# EasyEDA Pro project comparatorVCO.eprj, board PCB2_1
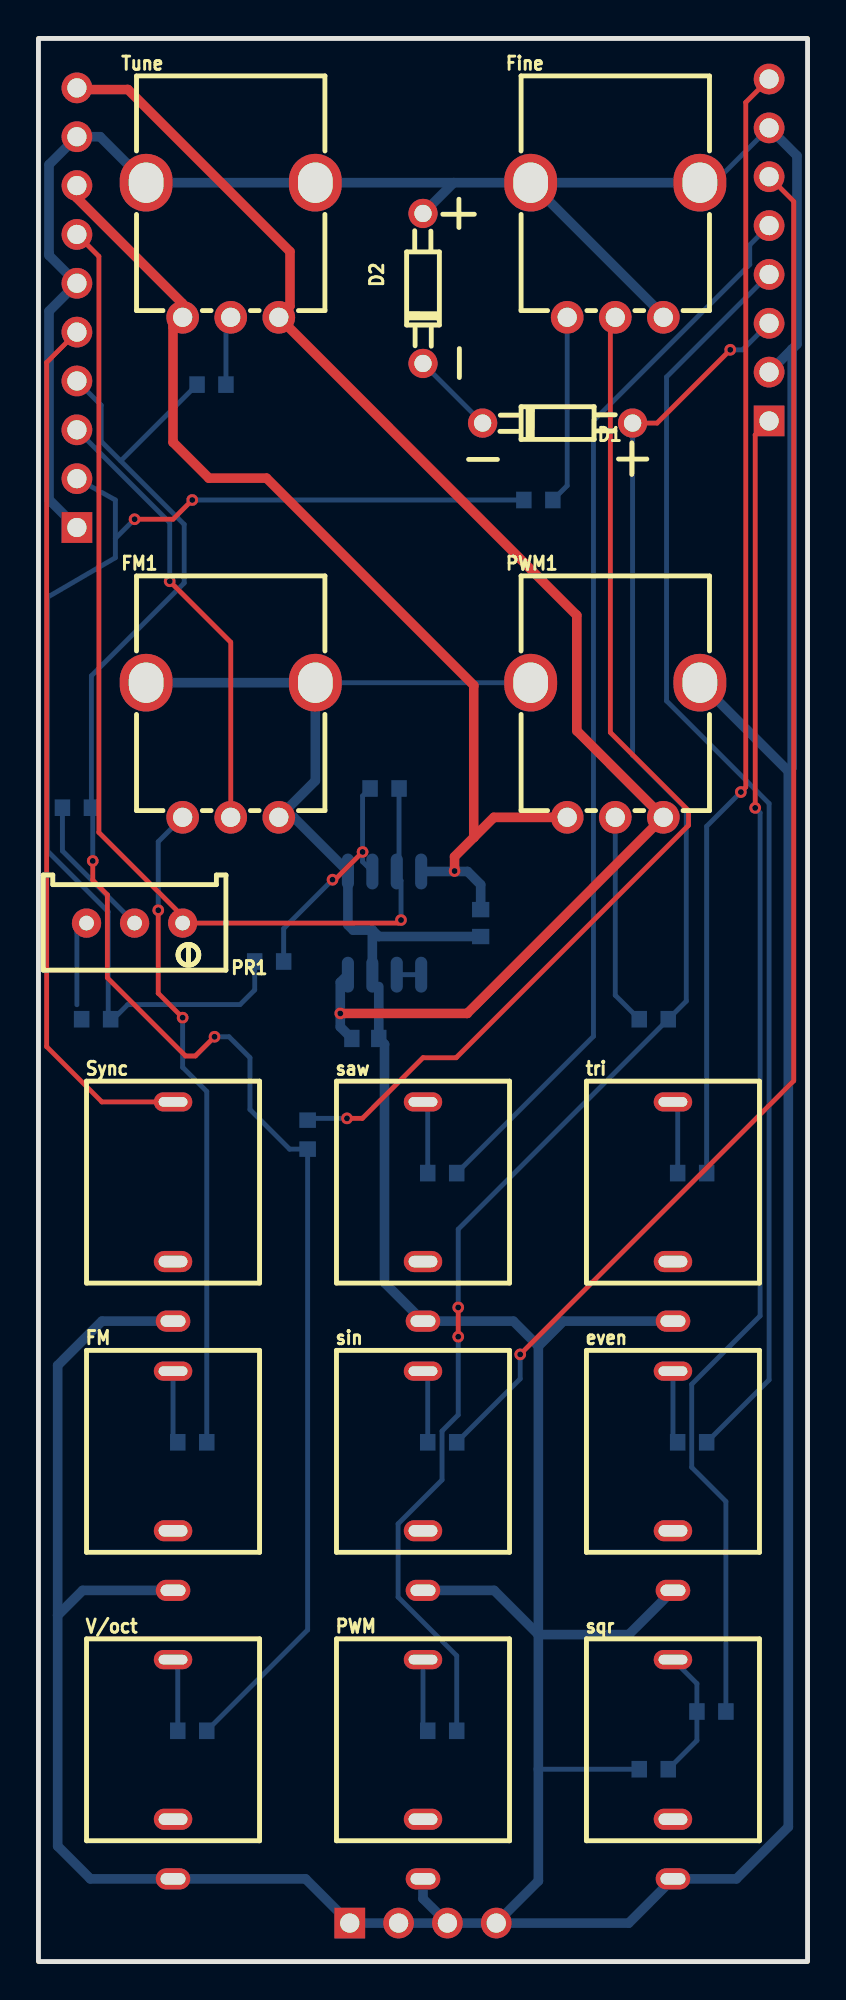
[diagram p8: board, top side]
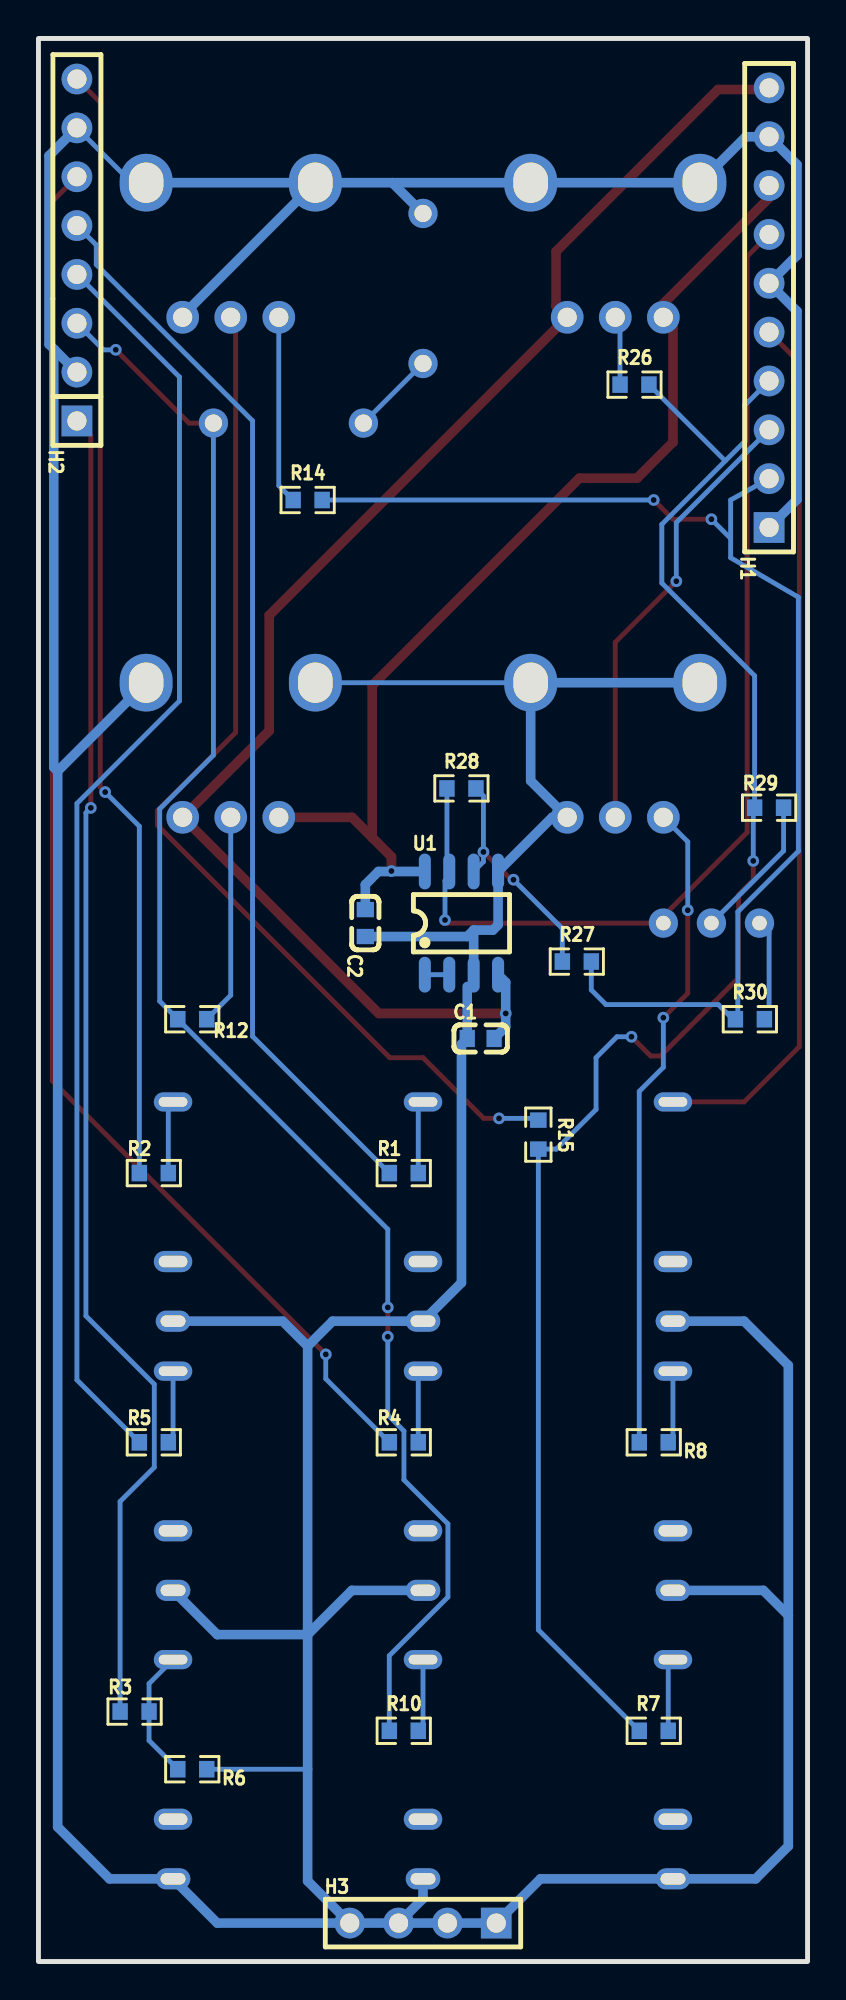
[diagram p9: board, bottom side, seen from below]

Outline 40 x 100 mm; copper layers: Top Layer, Bottom Layer. Coordinates in mm from the lower left corner of the outline.
Outline path: rectangle 0,100 40,0
Stack: Top Layer 0.035mm / Dielectric1 1.51mm FR4 er 4.5 / Bottom Layer 0.035mm

## Design rules (mm)
template: Custom Config
spacing copperThickness1oz (default): track to track 0.102, other pairs 0.152 to 0.3
spacing copperThickness2oz: track to track 0.203, other pairs 0.152 to 0.3
track width copperThickness1oz (default): min 0.127, default 0.254, max 2.54
track width copperThickness2oz: min 0.203, default 0.254, max 2.54
differential pair differentialPair (default): width min 0.127, default 0.254, max 2.54; gap min 0.152, default 0.152
via viaSize (default): diameter min 0.5, default 0.61, max 10; hole min 0.3, default 0.305, max 6.3

## Placement (name value [footprint] x y rotation side)
C1  100nF  [C0603]  17 48 180 bottom
C2  100nF  [C0603]  23 54 90 bottom
D1  BZX55C4V7-TAP  [DO-35_BD1.7-L3.8-P7.8-D0.5-FD]  27 80 180 top
D2  BZX55C4V7-TAP  [DO-35_BD1.7-L3.8-P7.8-D0.5-FD]  20 87 270 top
even  WQP-WQP518MA  [CONN-TH_WQP-WQP518MA]  33 25 0 top
Fine  100kΩ  [RES-ADJ-TH_RK09D1130C3C]  30 89 0 top
FM  WQP-WQP518MA  [CONN-TH_WQP-WQP518MA]  7 25 0 top
FM1  100kΩ  [RES-ADJ-TH_RK09D1130C3C]  10 63 0 top
H1  HTSW-110-07-G-S  [HDR-TH_TSW-110-17-F-S-LL]  2 86 90 bottom
H2  HTSW-108-22-T-S  [HDR-TH_HTSW-108-22-T-S]  38 89 90 bottom
H3  HTSW-104-18-F-S  [HDR-TH_HTSW-104-25-S-S-LL]  20 2 180 bottom
PR1  10kΩ  [RES-ADJ-TH_3P-L10.0-W10.0-P2.50-L]  5 54 180 top
PWM  WQP-WQP518MA  [CONN-TH_WQP-WQP518MA]  20 10 0 top
PWM1  100kΩ  [RES-ADJ-TH_RK09D1130C3C]  30 63 0 top
R1  1k  [R0603]  21 41 180 bottom
R2  1k  [R0603]  34 41 180 bottom
R3  3.3k  [R0603]  35 13 180 bottom
R4  1k  [R0603]  21 27 180 bottom
R5  1k  [R0603]  34 27 180 bottom
R6  3.3k  [R0603]  32 10 0 bottom
R7  100k 0.1%  [R0603]  8 12 0 bottom
R8  100K  [R0603]  8 27 0 bottom
R10  47k  [R0603]  21 12 0 bottom
R12  12k  [R0603]  32 49 0 bottom
R14  130k  [R0603]  26 76 0 bottom
R15  100k  [R0603]  14 43 270 bottom
R26  50k .1%  [R0603]  9 82 180 bottom
R27  10K  [R0603]  12 52 0 bottom
R28  10K  [R0603]  18 61 0 bottom
R29  100k  [R0603]  2 60 180 bottom
R30  36k  [R0603]  3 49 180 bottom
saw  WQP-WQP518MA  [CONN-TH_WQP-WQP518MA]  20 39 0 top
sin  WQP-WQP518MA  [CONN-TH_WQP-WQP518MA]  20 25 0 top
sqr  WQP-WQP518MA  [CONN-TH_WQP-WQP518MA]  33 10 0 top
Sync  WQP-WQP518MA  [CONN-TH_WQP-WQP518MA]  7 39 0 top
tri  WQP-WQP518MA  [CONN-TH_WQP-WQP518MA]  33 39 0 top
Tune  100kΩ  [RES-ADJ-TH_RK09D1130C3C]  10 89 0 top
U1  TL082  [SOP-8_L4.9-W3.9-P1.27-LS6.0-BL]  18 54 180 bottom
V/oct  WQP-WQP518MA  [CONN-TH_WQP-WQP518MA]  7 10 0 top

## Footprints (pads in the part's own frame, mm; a bottom-side part is the same pattern mirrored in y, then rotated)
C0603
  rect 0.8x0.9 smd: 1(-0.7,0) 2(0.7,0)
CONN-TH_WQP-WQP518MA
  oval 1.8x1.1 hole 1.3x0.6: 1(0,-5.7)
  oval 2x1.1 hole 1.5x0.6: 2(0,-2.6)
  oval 2x1 hole 1.5x0.5: 3(0,5.7)
DO-35_BD1.7-L3.8-P7.8-D0.5-FD
  round 1.524 hole 0.9: 1(3.9,0) 2(-3.9,0)
HDR-TH_HTSW-104-25-S-S-LL
  rect 1.6x1.6 hole 1: 1(3.81,0)
  round 1.6 hole 1: 2(1.27,0) 3(-1.27,0) 4(-3.81,0)
HDR-TH_HTSW-108-22-T-S
  rect 1.6x1.6 hole 1: 1(-8.89,0)
  round 1.6 hole 1: 2(-6.35,0) 3(-3.81,0) 4(-1.27,0) 5(1.27,0) 6(3.81,0) 7(6.35,0) 8(8.89,0)
HDR-TH_TSW-110-17-F-S-LL
  rect 1.6x1.6 hole 1: 1(-11.43,0)
  round 1.6 hole 1: 2(-8.89,0) 3(-6.35,0) 4(-3.81,0) 5(-1.27,0) 6(1.27,0) 7(3.81,0) 8(6.35,0) 9(8.89,0) 10(11.43,0)
R0603
  rect 0.806x0.864 smd: 1(-0.753,0) 2(0.753,0)
RES-ADJ-TH_3P-L10.0-W10.0-P2.50-L
  round 1.524 hole 0.762: 1(-2.5,0) 2(0,0) 3(2.5,0)
RES-ADJ-TH_RK09D1130C3C
  round 1.7 hole 1: 1(-2.5,-3.5) 2(0,-3.5) 3(2.5,-3.5)
  oval 2.75x3 hole 1.8x2.1: 4(-4.4,3.5) 5(4.4,3.5)
SOP-8_L4.9-W3.9-P1.27-LS6.0-BL
  oval 0.63x1.865 smd: 1(-1.905,-2.683) 2(-0.635,-2.683) 3(0.635,-2.683) 4(1.905,-2.683) 5(1.905,2.683) 6(0.635,2.683) 7(-0.635,2.683) 8(-1.905,2.683)

## Nets
As in the schematic.

Pads without a net: even 2; FM 2; PWM 2; saw 2; sin 2; sqr 2; Sync 2; tri 2; V/oct 2

## Via types
v1: diameter 0.61, hole 0.305, Top Layer to Bottom Layer, 19 vias

## Routing (per net, layer and track width the routed paths; a pad name or vN(x,y) marks a point on that pad's centre or on a via; arc(x,y) is an arc through that point)
+12V: length 56.7
  Top Layer w0.5: H1.8 2,91.71 7.5,86.21 Tune.1 7,85 7,79 8.86,77.14 11.86,77.14 22.64,66.36 22.64,58.45 ; v1(21.64,56.71) 21.64,57.45 22.64,58.45 ; 22.64,58.45 23.69,59.5 PWM1.1
  Bottom Layer w0.5: U1.8 22.32,56.68 23,56 C2.2
-12V: length 77.3
  Top Layer w0.5: v1(15.7,49.3) 22.3,49.3 PWM1.3 28,64 28,70 Tune.3 13.08,86.08 13.08,88.92 4.66,97.34 2.09,97.34 H1.10
  Bottom Layer w0.5: U1.4 15.7,50.92 v1(15.7,49.3) 15.7,48.6 C1.2
GND: length 381.7
  Bottom Layer w0.254: R6.1 26,10 ; FM1.5 PWM1.4 ; H2.7 35.15,92.5 Fine.5
  Bottom Layer w0.5: 21.6,92.5 Tune.5 Tune.4 3.21,94.89 H1.9 0.55,93.44 0.55,88.72 H1.6 0.55,85.82 0.55,76.02 H1.1 ; 21.6,92.5 Fine.4 ; 21.6,92.5 D2.2 ; H2.7 39.45,93.9 39.45,84.1 39.18,83.83 ; 26,32 27.3,33.3 tri.1 ; 26,32 26,17 ; 26,32 24.7,33.3 saw.1 18,35.3 18,47.7 C1.1 17.7,50.7 ; even.1 30.7,17 26,17 ; H3.4 26,4.19 26,17 ; H3.4 30.7,2 sqr.1 36.3,4.3 39,7 39,61.9 ; H3.4 H3.3 ; Fine.4 Fine.5 ; Fine.4 32.5,85.6 Fine.3 ; 17.37,53.64 17.7,53.3 C2.1 ; 17.37,53.64 16.37,53.64 16.09,53.91 U1.5 13.28,59.5 FM1.3 14.4,61.4 FM1.5 FM1.4 ; 17.37,53.64 U1.3 ; 39.18,83.83 H2.2 ; 39.18,83.83 39.2,83.8 39.2,62.1 39,61.9 ; 26,17 23.7,19.3 sin.1 ; PWM.1 20,3.27 H3.3 ; H3.3 H3.2 H3.1 13.89,4.3 V/oct.1 2.7,4.3 1,6 1,18 ; 1,18 1,31 3.3,33.3 Sync.1 ; 1,18 2.3,19.3 FM.1 ; 39,61.9 PWM1.5
-V_REF: length 56.6
  Top Layer w0.254: 7.71,54.14 7.64,54.14 PR1.1 ; 7.71,54.14 3.14,58.71 3.14,88.67 H1.7 ; 7.71,54.14 7.86,54 18.7,54 v1(18.86,54.16)
  Bottom Layer w0.254: R28.2 18.75,56.8 U1.7 18.63,56.43 18.86,56.21 v1(18.86,54.16)
EVEN_OUT: length 66.5
  Bottom Layer w0.254: H2.4 32.67,82.4 32.67,65.55 38,60.22 38,30.25 R5.1
FM_IN: length 23.5
  Top Layer w0.254: FM1.2 10,68.6 v1(6.83,71.78)
  Bottom Layer w0.254: v1(6.83,71.78) 6.83,74.82 H1.3
PW_IN: length 85.9
  Top Layer w0.254: v1(35.98,83.81) 32.17,80 D1.2 ; v1(21.83,34.01) v1(21.83,32.49)
  Bottom Layer w0.254: v1(21.83,34.01) 21.83,38.08 R12.2 33.69,49.94 33.69,59.93 30.9,62.73 D1.2 ; v1(35.98,83.81) 36.62,83.81 H2.3 ; R10.2 21.75,15.9 18.71,18.95 18.71,22.76 20.99,25.05 20.99,27.59 21.83,28.43 v1(21.83,32.49)
PW_OUT: length 69.7
  Top Layer w0.254: v1(37.28,59.99) 37.28,79.39 H2.1
  Bottom Layer w0.254: v1(37.28,59.99) 37.53,59.74 37.53,33.57 33.98,30.02 33.98,25.7 35.75,23.92 R3.1
SAW_OUT: length 56
  Bottom Layer w0.254: R1.1 28.87,48.11 28.87,80.12 36.99,88.24 36.99,89.26 H2.5
SIN_OUT: length 73.6
  Top Layer w0.254: v1(25.06,31.57) 39.28,45.8 39.28,91.53 H2.6
  Bottom Layer w0.254: R4.1 25.06,30.3 v1(25.06,31.57)
SYNC: length 45.6
  Top Layer w0.254: H1.5 0.43,83.16 0.43,47.57 3.3,44.7 Sync.3
TRI_OUT: length 58.2
  Top Layer w0.254: v1(36.53,60.81) 36.79,61.07 36.79,96.68 H2.8
  Bottom Layer w0.254: R2.1 34.75,59.03 v1(36.53,60.81)
V_OCT_IN: length 90.2
  Top Layer w0.254: v1(9.16,48.09) 8.16,47.09 7.65,47.09 3.59,51.15 3.59,55.47 2.82,56.23 v1(2.82,57.23)
  Bottom Layer w0.254: H1.4 3.26,80.93 3.26,79.05 7.58,74.73 7.58,71.68 2.75,66.86 R29.1 2.82,59.93 v1(2.82,57.23) ; R7.2 14,17.25 R15.2 13.06,42.25 11,44.31 11,47 9.91,48.09 v1(9.16,48.09) ; 4.28,78.03 R26.2
V_REF: length 64.4
  Top Layer w0.254: v1(8,76) 7,75 v1(5,75)
  Bottom Layer w0.254: v1(5,75) 4,74 ; 4,74 4,73 0.48,70.95 0.48,57.74 3.63,54.59 3.63,49 3.88,49 4.64,49.76 10.48,49.76 11.25,50.52 R27.1 ; 4,74 4,76 H1.2 ; R14.1 v1(8,76)
$1N379: length 3.8
  Bottom Layer w0.254: saw.3 20.25,44.45 R1.2
$1N459: length 3.8
  Bottom Layer w0.254: tri.3 33.25,44.45 R2.2
$1N485: length 6.8
  Bottom Layer w0.254: sqr.3 34.25,14.45 R3.2 34.25,11.49 R6.2
$1N511: length 3.8
  Bottom Layer w0.254: R4.2 20.25,30.45 sin.3
$1N537: length 3.8
  Bottom Layer w0.254: even.3 33,27.25 R5.2
$1N977: length 3.8
  Bottom Layer w0.254: R7.1 7.25,15.45 V/oct.3
$1N1003: length 3.8
  Bottom Layer w0.254: FM.3 7,27.25 R8.1
$1N1055: length 3.8
  Bottom Layer w0.254: R10.1 20,12.25 PWM.3
$1N1199: length 11
  Bottom Layer w0.254: PWM1.2 30,50.25 R12.1
$1N1336: length 4.4
  Bottom Layer w0.254: D1.1 D2.1
$1N1602: length 9.8
  Bottom Layer w0.254: R14.2 27.5,76.75 Fine.1
$1N1651: length 54.4
  Top Layer w0.254: v1(16.05,43.84) 16.84,43.84 20,47 21.73,47 33.81,59.08 33.81,59.85 29.75,63.91 29.75,85.25 Fine.2
  Bottom Layer w0.254: v1(16.05,43.84) 14.09,43.84 R15.1
$1N2918: length 12.2
  Top Layer w0.254: v1(15.29,56.25) 15.41,56.25 v1(16.86,57.7)
  Bottom Layer w0.254: v1(15.29,56.25) 12.75,53.71 R27.2 ; R28.1 16.86,60.61 v1(16.86,57.7) 16.86,57.19 U1.6
$1N3569: length 3.6
  Bottom Layer w0.254: Tune.2 9.75,85.25 R26.1
$1N5861: length 7.6
  Bottom Layer w0.254: R29.2 1.25,57.75 PR1.2
$1N5947: length 4.5
  Bottom Layer w0.254: 2,49.75 2,53.5 PR1.3
$1N8161: length 1.3
  Bottom Layer w0.254: U1.1 U1.2
$1N8571: length 34.1
  Top Layer w0.254: v1(7.5,49.08) 6.23,50.35 v1(6.23,54.67)
  Bottom Layer w0.254: R8.2 8.75,45.25 7.5,46.5 v1(7.5,49.08) ; v1(6.23,54.67) 6.23,58.23 FM1.1
